# EAGLE design EsquematicoCorregido (EAGLE 9.6.2)
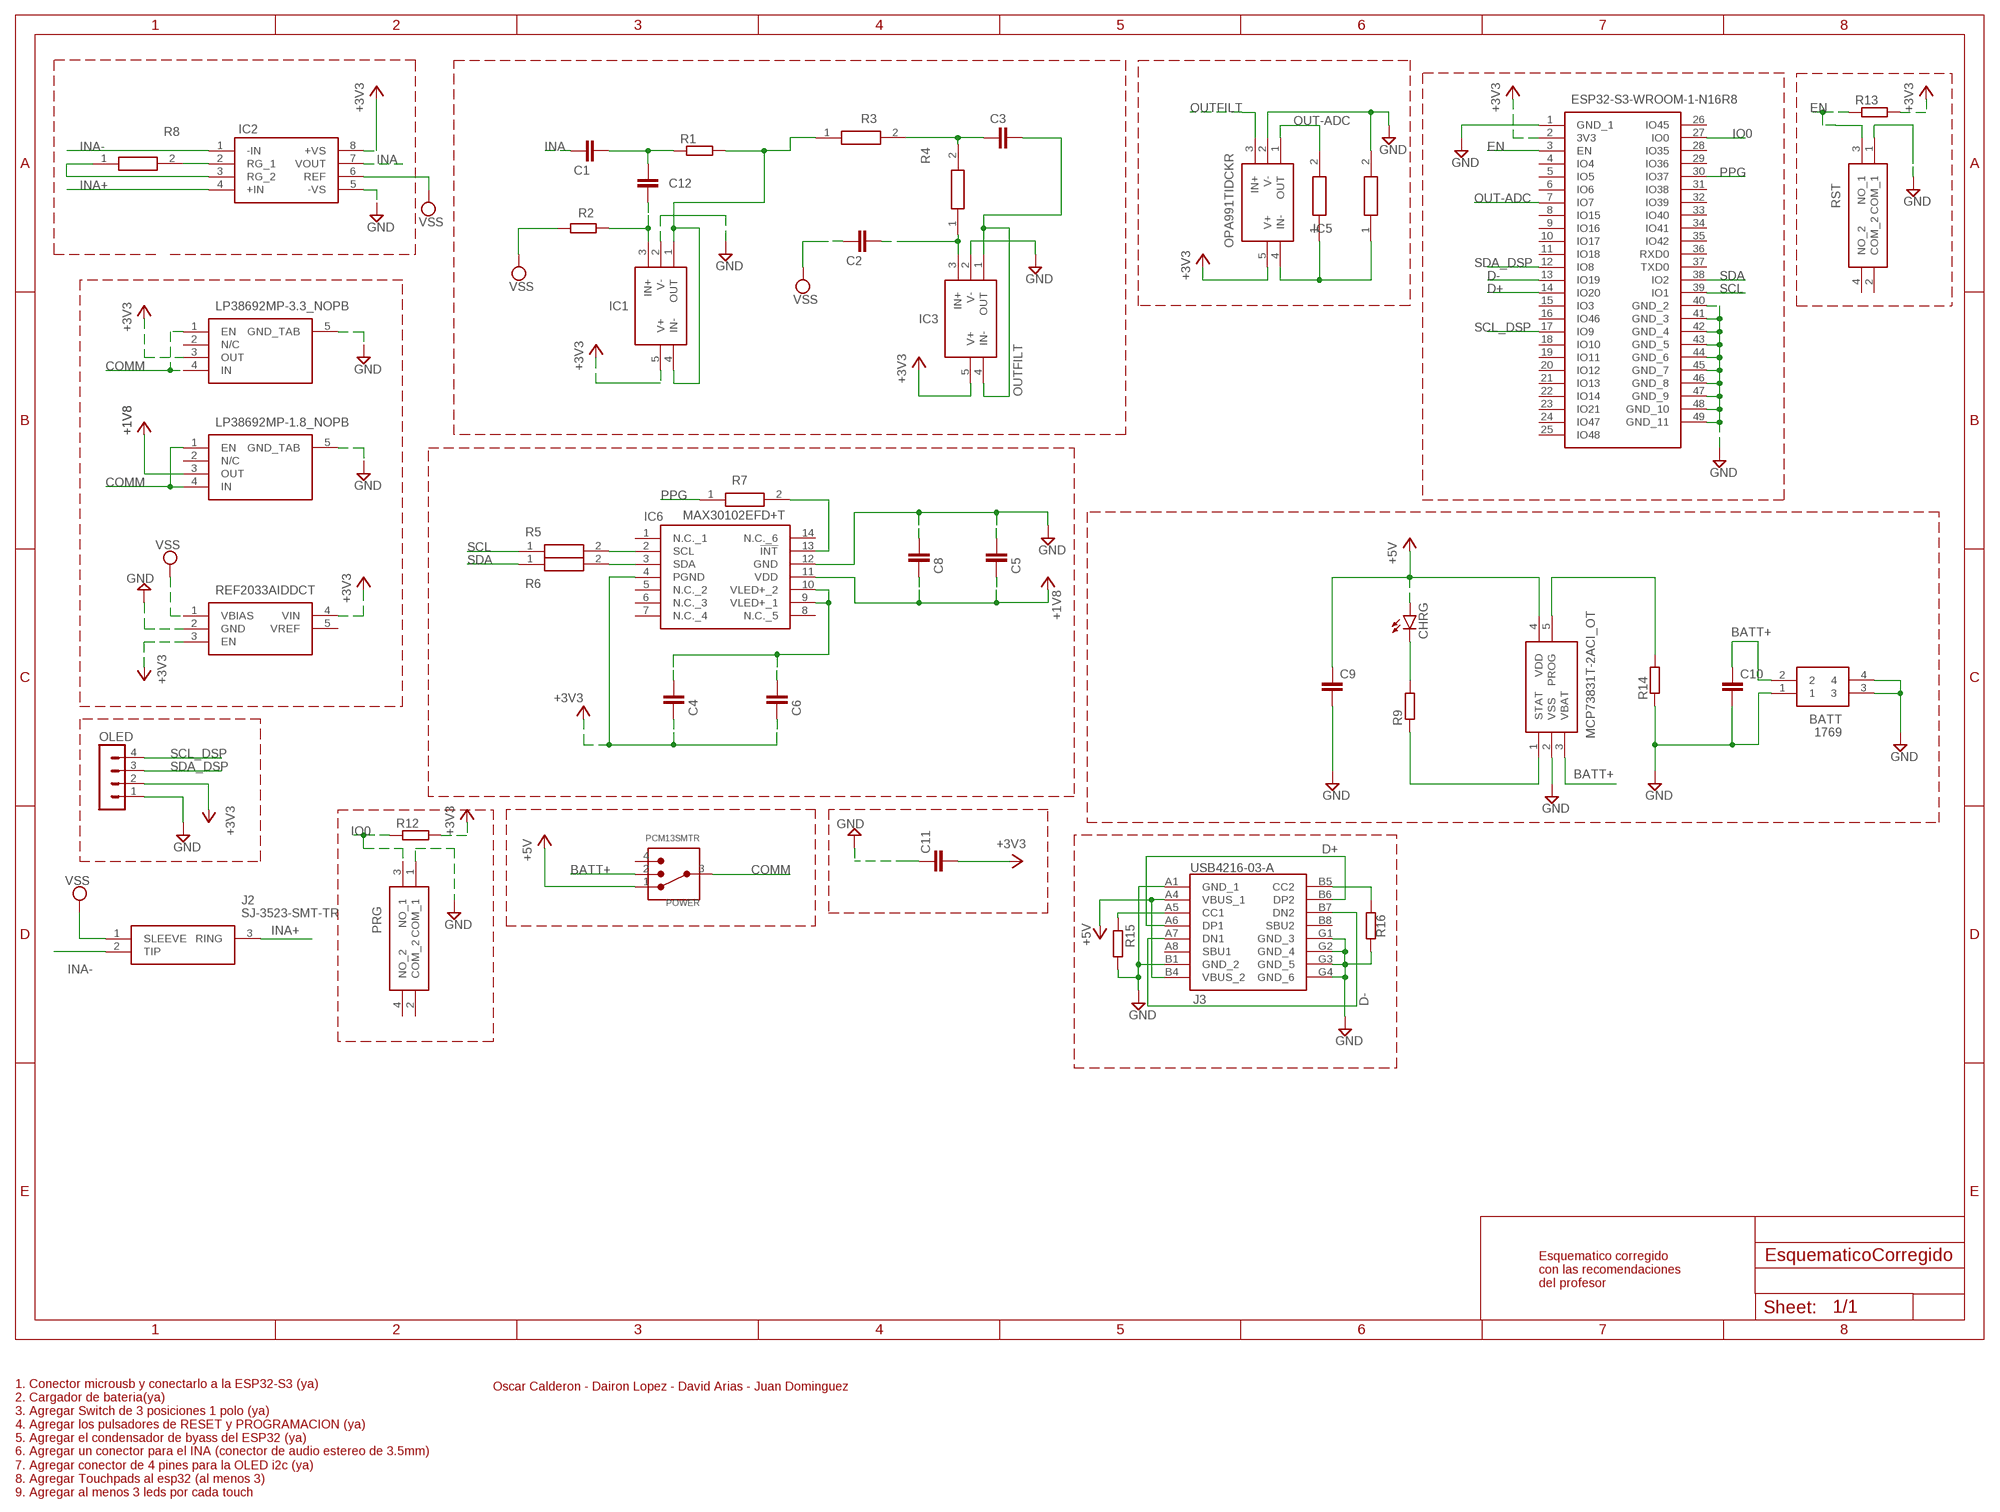
[diagram p0: schematic, sheet 1]

## Parts
BATT  1769  [1769]
C1  C-EUC0805  [C0805]
C2  C-EUC0805  [C0805]
C3  C-EUC0805  [C0805]
C4  C-EUC0805  [C0805]
C5  C-EUC0805  [C0805]
C6  C-EUC0805  [C0805]
C8  C-EUC0805  [C0805]
C9  C-EUC0805  [C0805]
C10  C-EUC0805  [C0805]
C11  C-EUC0805  [C0805]
C12  C-EUC0805  [C0805]
CHRG  LEDCHIP-LED0805  [CHIP-LED0805]
IC1  OPA991TIDCKR  [SOT65P210X110-5N]
IC2  AD8226ARZ-RL  [SOIC127P600X175-8N]
IC3  OPA991TIDCKR  [SOT65P210X110-5N]
IC4  ESP32-S3-WROOM-1-N16R8  [ESP32S3WROOM1N16R8]
IC5  OPA991TIDCKR  [SOT65P210X110-5N]
IC6  MAX30102EFD+T  [MAX30102EFDT]
IC7  LP38692MP-3.3_NOPB  [SOT150P700X180-5N]
IC8  LP38692MP-1.8_NOPB  [SOT150P700X180-5N]
IC9  REF2033AIDDCT  [SOT95P280X110-5N]
IC10  MCP73831T-2ACI_OT  [SOT95P270X145-5N]
J2  SJ-3523-SMT-TR  [SJ3523SMTTR]
J3  USB4216-03-A  [USB421603A]
OLED  MA04-1  [MA04-1]
POWER  PCM13SMTR  [SW_PCM13SMTR]
PRG  PTS526SK15SMTR2_LFS  [PTS526SK15SMTR2LFS]
R1  R-EU_R0805  [R0805]
R2  R-EU_R0805  [R0805]
R3  ERA-6ARW122V  [ERA6AEB101V]
R4  ERA-6ARW122V  [ERA6AEB101V]
R5  CRCW08051K00FKTAHP  [RESC2012X60N]
R6  CRCW08051K00FKTAHP  [RESC2012X60N]
R7  CRCW08051K00FKTAHP  [RESC2012X60N]
R8  RN73H1JTTD1043B50  [RESC1608X55N]
R9  R-EU_R0805  [R0805]
R10  CRCW0805220RFKTAHP  [RESC2012X60N]
R11  CRCW0805220RFKTAHP  [RESC2012X60N]
R12  R-EU_R0805  [R0805]
R13  R-EU_R0805  [R0805]
R14  R-EU_R0805  [R0805]
R15  R-EU_R0805  [R0805]
R16  R-EU_R0805  [R0805]
RST  PTS526SK15SMTR2_LFS  [PTS526SK15SMTR2LFS]

## Nets
+1V8: C5.1 C8.1 IC6.11(VDD) IC8.3(OUT) ; supply symbol labelled +3V3
+3V3: C4.1 C6.1 C11.2 IC1.5(V+) IC2.8(+VS) IC3.5(V+) IC4.2(3V3) IC5.5(V+) IC6.4(PGND) IC7.3(OUT) IC9.3(EN) IC9.4(VIN) OLED.2 R12.2 R13.2
+5V: C9.1 CHRG.A IC10.4(VDD) J3.A4(VBUS_1) J3.B4(VBUS_2) POWER.1
BATT+: BATT.2 C10.1 IC10.3(VBAT) POWER.2
COMM: IC7.1(EN) IC7.4(IN) IC8.1(EN) IC8.4(IN) POWER.3
D+: IC4.14(IO20) J3.A6(DP1) J3.B6(DP2)
D-: IC4.13(IO19) J3.A7(DN1) J3.B7(DN2)
EN: IC4.3(EN) R13.1 RST.3(NO_1)
GND: BATT.1 BATT.3 BATT.4 C5.2 C8.2 C9.2 C10.2 C11.1 IC1.2(V-) IC2.5(-VS) IC3.2(V-) IC4.1(GND_1) IC4.40(GND_2) IC4.41(GND_3) IC4.42(GND_4) IC4.43(GND_5) IC4.44(GND_6) IC4.45(GND_7) IC4.46(GND_8) IC4.47(GND_9) IC4.48(GND_10) IC4.49(GND_11) IC5.2(V-) IC6.12(GND) IC7.5(GND_TAB) IC8.5(GND_TAB) IC9.2(GND) IC10.2(VSS) J3.A1(GND_1) J3.B1(GND_2) J3.G1(GND_3) J3.G2(GND_4) J3.G3(GND_5) J3.G4(GND_6) OLED.1 PRG.1(COM_1) R11.2 R14.1 R15.2 R16.1 RST.1(COM_1)
INA: C1.1 IC2.7(VOUT)
INA+: IC2.4(+IN) J2.3(RING)
INA-: IC2.1(-IN) J2.2(TIP)
IO0: IC4.27(IO0) PRG.3(NO_1) R12.1
N$1: C3.2 R3.2 R4.2
N$2: C1.2 C12.2 R1.1
N$3: C12.1 IC1.3(IN+) R2.2
N$4: C2.2 IC3.3(IN+) R4.1
N$5: IC5.4(IN-) R10.1 R11.1
N$6: IC1.1(OUT) IC1.4(IN-) R1.2 R3.1
N$7: IC2.2(RG_1) R8.2
N$8: IC6.13(!INT) R7.2
N$9: C4.2 C6.2 IC6.9(VLED+_1) IC6.10(VLED+_2)
N$11: IC2.3(RG_2) R8.1
N$12: IC6.3(SDA) R6.2
N$13: IC6.2(SCL) R5.2
N$14: CHRG.C R9.2
N$16: J3.A5(CC1) R15.1
N$17: IC10.5(PROG) R14.2
N$18: IC10.1(STAT) R9.1
N$19: J3.B5(CC2) R16.2
OUT-ADC: IC4.7(IO7) IC5.1(OUT) R10.2
OUTFILT: C3.1 IC3.1(OUT) IC3.4(IN-) IC5.3(IN+)
PPG: IC4.30(IO37) R7.1
SCL: IC4.39(IO1) R5.1
SCL_DSP: IC4.17(IO9) OLED.4
SDA: IC4.38(IO2) R6.1
SDA_DSP: IC4.12(IO8) OLED.3
VSS: C2.1 IC2.6(REF) IC9.1(VBIAS) J2.1(SLEEVE) R2.1
Unconnected: IC4.4(IO4) IC4.5(IO5) IC4.6(IO6) IC4.8(IO15) IC4.9(IO16) IC4.10(IO17) IC4.11(IO18) IC4.15(IO3) IC4.16(IO46) IC4.18(IO10) IC4.19(IO11) IC4.20(IO12) IC4.21(IO13) IC4.22(IO14) IC4.23(IO21) IC4.24(IO47) IC4.25(IO48) IC4.26(IO45) IC4.28(IO35) IC4.29(IO36) IC4.31(IO38) IC4.32(IO39) IC4.33(IO40) IC4.34(IO41) IC4.35(IO42) IC4.36(RXD0) IC4.37(TXD0) IC6.1(N.C._1) IC6.5(N.C._2) IC6.6(N.C._3) IC6.7(N.C._4) IC6.8(N.C._5) IC6.14(N.C._6) IC7.2(N/C) IC8.2(N/C) IC9.5(VREF) J3.A8(SBU1) J3.B8(SBU2) POWER.4 PRG.2(COM_2) PRG.4(NO_2) RST.2(COM_2) RST.4(NO_2)

## Notes on the sheet
- Esquematico corregido
  con las recomendaciones
  del profesor
- Oscar Calderon - Dairon Lopez - David Arias - Juan Dominguez
- 1. Conector microusb y conectarlo a la ESP32-S3 (ya)
  2. Cargador de bateria(ya)
  3. Agregar Switch de 3 posiciones 1 polo (ya)
  4. Agregar los pulsadores de RESET y PROGRAMACION (ya)
  5. Agregar el condensador de byass del ESP32 (ya)
- 6. Agregar un conector para el INA (conector de audio estereo de 3.5mm)
- 7. Agregar conector de 4 pines para la OLED i2c (ya)
  8. Agregar Touchpads al esp32 (al menos 3)
  9. Agregar al menos 3 leds por cada touch

## Library data of the parts
BATT = 1769:1769: Adafruit Accessories JST-PH 2-pin SMT Right Angle Connect Source: Datasheet <https://cdn-shop.adafruit.com/datasheets/17311.pdf>; DESCRIPTION: Adafruit Accessories JST-PH 2-pin SMT Right Angle Connect; HEIGHT: 5.5mm; MANUFACTURER_NAME: Adafruit; MANUFACTURER_PART_NUMBER: 1769; MOUSER_PART_NUMBER: 485-1769; MOUSER_PRICE-STOCK: https://www.mouser.co.uk/ProductDetail/Adafruit/1769?qs=GURawfaeGuBbgoGtf2XstA%3D%3D
C1-C6 C8-C12 = rcl:C-EU: CAPACITOR, European symbol; SPICEPREFIX: C
CHRG = led:LED: LED OSRAM: - CHIPLED LG R971, LG N971, LY N971, LG Q971, LY Q971, LO R971, LY R971 LH N974, LH R974 LS Q976, LO Q976, LY Q976 LO Q996 - Hyper CHIPLED LW Q18S LB Q993, LB Q99A, LB R99A - SideLED LS A670, LO A670, LY A670, LG A670, LP A670 LB A673, LV A673, LT A673, LW A673 LH A674 LY A675 LS A676, LA A676, LO A676, LY A676, LW A676 LS A679, LY A679, LG A679 - Hyper Micro SIDELED® LS Y876, LA Y876, LO Y876, LY Y876 LT Y87S - SmartLED LW L88C, LW L88S LB L89C, LB L89S, LG L890 LS L89K, LO L89K, LY L89K LS L896, LA L896, LO L896, LY L896 - TOPLED LS T670, LO T670, LY T670, LG T670, LP T670 LSG T670, LSP T670, LSY T670, LOP T670, LYG T670 LG T671, LOG T671, LSG T671 LB T673, LV T673, LT T673, LW T673 LH T674 LS T676, LA T676, LO T676, LY T676, LB T676, LH T676, LSB T676, LW T676 LB T67C, LV T67C, LT T67C, LS T67K, LO T67K, LY T67K, LW E67C LS E67B, LA E67B, LO E67B, LY E67B, LB E67C, LV E67C, LT E67C LW T67C LS T679, LY T679, LG T679 LS T770, LO T770, LY T770, LG T770, LP T770 LB T773, LV T773, LT T773, LW T773 LH T774 LS E675, LA E675, LY E675, LS T675 LS T776, LA T776, LO T776, LY T776, LB T776 LHGB T686 LT T68C, LB T68C - Hyper Mini TOPLED® LB M676 - Mini TOPLED Santana® LG M470 LS M47K, LO M47K, LY M47K Source: http://www.osram.convergy.de LUXEON: - LUMILED® LXK2-PW12-R00, LXK2-PW12-S00, LXK2-PW14-U00, LXK2-PW14-V00 LXK2-PM12-R00, LXK2-PM12-S00, LXK2-PM14-U00 LXK2-PE12-Q00, LXK2-PE12-R00, LXK2-PE12-S00, LXK2-PE14-T00, LXK2-PE14-U00 LXK2-PB12-K00, LXK2-PB12-L00, LXK2-PB12-M00, LXK2-PB14-N00, LXK2-PB14-P00, LXK2-PB14-Q00 LXK2-PR12-L00, LXK2-PR12-M00, LXK2-PR14-Q00, LXK2-PR14-R00 LXK2-PD12-Q00, LXK2-PD12-R00, LXK2-PD12-S00 LXK2-PH12-R00, LXK2-PH12-S00 LXK2-PL12-P00, LXK2-PL12-Q00, LXK2-PL12-R00 Source: www.luxeon.com KINGBRIGHT: KA-3528ASYC Source: www.kingbright.com
IC1 IC3 IC5 = OPA991TIDCKR:OPA991TIDCKR: Operational Amplifiers - Op Amps 40-V, single 4.5MHz, rail-to-rail input/output, low-offset-voltage, low-noise op amp Source: Datasheet; DESCRIPTION: Operational Amplifiers - Op Amps 40-V, single 4.5MHz, rail-to-rail input/output, low-offset-voltage, low-noise op amp; HEIGHT: 1.1mm; MANUFACTURER_NAME: Texas Instruments; MANUFACTURER_PART_NUMBER: OPA991TIDCKR; MOUSER_PART_NUMBER: 595-OPA991TIDCKR; MOUSER_PRICE-STOCK: https://www.mouser.co.uk/ProductDetail/Texas-Instruments/OPA991TIDCKR?qs=Wj%2FVkw3K%252BMD%2FIzu2Yv2xzw%3D%3D
IC2 = AD8226ARZ-RL:AD8226ARZ-RL: Wide Supply Range, Rail-to-Rail Output Instrumentation Amplifier Source: Datasheet <https://componentsearchengine.com/Datasheets/1/AD8226ARZ-RL.pdf>; DESCRIPTION: Wide Supply Range, Rail-to-Rail Output Instrumentation Amplifier; HEIGHT: 1.75mm; MANUFACTURER_NAME: Analog Devices; MANUFACTURER_PART_NUMBER: AD8226ARZ-RL; MOUSER_PART_NUMBER: 584-AD8226ARZ-R; MOUSER_PRICE-STOCK: https://www.mouser.co.uk/ProductDetail/Analog-Devices/AD8226ARZ-RL?qs=%2FtpEQrCGXCyR%252B4VhfaaPUA%3D%3D
IC4 = ESP32-S3-WROOM-1-N16R8:ESP32-S3-WROOM-1-N16R8: Multiprotocol Modules SMD Module, ESP32-S3R8, 3.3V, 8 MB Octal PSRAM Die, 16 MB Quad SPI Flash, PCB Antenna Source: Datasheet <https://www.espressif.com/sites/default/files/documentation/esp32-s3-wroom-1_wroom-1u_datasheet_en.pdf>; DESCRIPTION: Multiprotocol Modules SMD Module, ESP32-S3R8, 3.3V, 8 MB Octal PSRAM Die, 16 MB Quad SPI Flash, PCB Antenna; HEIGHT: 3.25mm; MANUFACTURER_NAME: Espressif Systems; MANUFACTURER_PART_NUMBER: ESP32-S3-WROOM-1-N16R8; MOUSER_PART_NUMBER: 356-ESP32S3WRM1N16R8; MOUSER_PRICE-STOCK: https://www.mouser.co.uk/ProductDetail/Espressif-Systems/ESP32-S3-WROOM-1-N16R8?qs=Li%252BoUPsLEnvQc9gW6AMhZg%3D%3D
IC6 = MAX30102EFD+T:MAX30102EFD+T: Biometric Sensors Integrated Optical Sensor Source: Datasheet <https://www.analog.com/media/en/technical-documentation/data-sheets/MAX30102.pdf>; DESCRIPTION: Biometric Sensors Integrated Optical Sensor; HEIGHT: 1.65mm; MANUFACTURER_NAME: Analog Devices; MANUFACTURER_PART_NUMBER: MAX30102EFD+T; MOUSER_PART_NUMBER: 700-MAX30102EFD+T; MOUSER_PRICE-STOCK: https://www.mouser.co.uk/ProductDetail/Analog-Devices-Maxim-Integrated/MAX30102EFD%2bT?qs=nVS1qgv%252BQrkHA4%2FoFYriFA%3D%3D
IC7 = LP38692MP-3.3_NOPB:LP38692MP-3.3_NOPB: LP38692MP-3.3/NOPB, Low Dropout Voltage Regulator, 1A, 3.3 V +/-2.5%, 2.7 10 Vin, 5-Pin SOT-223 Source: Datasheet <http://www.ti.com/lit/ds/symlink/lp38692.pdf>; DESCRIPTION: LP38692MP-3.3/NOPB, Low Dropout Voltage Regulator, 1A, 3.3 V +/-2.5%, 2.7 10 Vin, 5-Pin SOT-223; HEIGHT: 1.8mm; MANUFACTURER_NAME: Texas Instruments; MANUFACTURER_PART_NUMBER: LP38692MP-3.3/NOPB; MOUSER_PART_NUMBER: 926-LP38692MP3.3NOPB; MOUSER_PRICE-STOCK: https://www.mouser.co.uk/ProductDetail/Texas-Instruments/LP38692MP-3.3-NOPB?qs=1FNqv8aZn1TpKuOP2NKBdg%3D%3D
IC8 = LP38692MP-1.8_NOPB:LP38692MP-1.8_NOPB: LP38692MP-1.8/NOPB, Low Dropout Voltage Regulator, 1A, 1.8 V +/-2.5%, 2.7 10 Vin, 5-Pin SOT-223 Source: Datasheet <http://www.ti.com/lit/ds/symlink/lp38692.pdf>; DESCRIPTION: LP38692MP-1.8/NOPB, Low Dropout Voltage Regulator, 1A, 1.8 V +/-2.5%, 2.7 10 Vin, 5-Pin SOT-223; HEIGHT: 1.8mm; MANUFACTURER_NAME: Texas Instruments; MANUFACTURER_PART_NUMBER: LP38692MP-1.8/NOPB; MOUSER_PART_NUMBER: 926-LP38692MP18NOPB; MOUSER_PRICE-STOCK: https://www.mouser.co.uk/ProductDetail/Texas-Instruments/LP38692MP-1.8-NOPB?qs=1FNqv8aZn1ScMhd5Fp7uyA%3D%3D
IC9 = REF2033AIDDCT:REF2033AIDDCT: Low-Drift, Low-Power, Dual-Output VREF and VREF/2 Voltage Reference Source: Datasheet <http://www.ti.com/lit/gpn/ref2033>; DESCRIPTION: Low-Drift, Low-Power, Dual-Output VREF and VREF/2 Voltage Reference; HEIGHT: 1.1mm; MANUFACTURER_NAME: Texas Instruments; MANUFACTURER_PART_NUMBER: REF2033AIDDCT; MOUSER_PART_NUMBER: 595-REF2033AIDDCT; MOUSER_PRICE-STOCK: https://www.mouser.co.uk/ProductDetail/Texas-Instruments/REF2033AIDDCT?qs=7z%252BmIopC6%2FIc00c0wUqUCA%3D%3D
IC10 = MCP73831T-2ACI_OT:MCP73831T-2ACI_OT: Li-Ion Charge Controller 4.2V SOT23-5 Source: Datasheet <http://ww1.microchip.com/downloads/en/DeviceDoc/20001984g.pdf>; DESCRIPTION: Li-Ion Charge Controller 4.2V SOT23-5; HEIGHT: 1.45mm; MANUFACTURER_NAME: Microchip; MANUFACTURER_PART_NUMBER: MCP73831T-2ACI/OT; MOUSER_PART_NUMBER: 579-MCP73831T-2ACIOT; MOUSER_PRICE-STOCK: https://www.mouser.co.uk/ProductDetail/Microchip-Technology/MCP73831T-2ACI-OT?qs=yUQqVecv4qvbBQBGbHx0Mw%3D%3D
J2 = SJ-3523-SMT-TR:SJ-3523-SMT-TR: 3.5 mm, Stereo, Right Angle, Surface Mount (SMT), 3 Conductors, 0 Internal Switches, Audio Jack Connector Source: Datasheet <https://www.sameskydevices.com/product/resource/sj-352x-smt.pdf>; DESCRIPTION: 3.5 mm, Stereo, Right Angle, Surface Mount (SMT), 3 Conductors, 0 Internal Switches, Audio Jack Connector; HEIGHT: 5.2mm; MANUFACTURER_NAME: Same Sky; MANUFACTURER_PART_NUMBER: SJ-3523-SMT-TR; MOUSER_PART_NUMBER: 490-SJ-3523-SMT-TR; MOUSER_PRICE-STOCK: https://www.mouser.co.uk/ProductDetail/CUI-Devices/SJ-3523-SMT-TR?qs=WyjlAZoYn51zOHzJ3r4ZRA%3D%3D
J3 = USB4216-03-A:USB4216-03-A: USB Connectors USB C Receptacle, Short Body, USB2.0, 16Pin, Horizontal, SMT Source: Datasheet; DESCRIPTION: USB Connectors USB C Receptacle, Short Body, USB2.0, 16Pin, Horizontal, SMT; HEIGHT: mm; MANUFACTURER_NAME: GCT (GLOBAL CONNECTOR TECHNOLOGY); MANUFACTURER_PART_NUMBER: USB4216-03-A; MOUSER_PART_NUMBER: 640-USB4216-03-A; MOUSER_PRICE-STOCK: https://www.mouser.co.uk/ProductDetail/GCT/USB4216-03-A?qs=Tc%252BHE9vUsnv1G2UWLFIexA%3D%3D
OLED = con-lstb:MA04-1: PIN HEADER; OC_FARNELL: unknown; OC_NEWARK: unknown
POWER = PCM13SMTR:PCM13SMTR: Check availability <https://pricing.snapeda.com/parts/PCM13SMTR/C%26K/view-part?ref=eda>; AVAILABILITY: In Stock; CHECK_PRICES: https://www.snapeda.com/parts/PCM13SMTR/C%2526K/view-part/?ref=eda; DESCRIPTION: Slide Switch SP3T Surface Mount, Right Angle; MF: C&K; MP: PCM13SMTR; PACKAGE: None; PRICE: None; SNAPEDA_LINK: https://www.snapeda.com/parts/PCM13SMTR/C%2526K/view-part/?ref=snap
PRG RST = PTS526SK15SMTR2_LFS:PTS526SK15SMTR2_LFS: Tactile Switches 50mA 12VDC, 5.2x5.2mm, 1.5mm H, 260gf, G leads, No ground pin, metal actuator Source: Datasheet <https://www.ckswitches.com/media/2780/pts526.pdf>; DESCRIPTION: Tactile Switches 50mA 12VDC, 5.2x5.2mm, 1.5mm H, 260gf, G leads, No ground pin, metal actuator; HEIGHT: 1.65mm; MANUFACTURER_NAME: C & K COMPONENTS; MANUFACTURER_PART_NUMBER: PTS526SK15SMTR2 LFS; MOUSER_PART_NUMBER: 611-PTS526SK15SMR2L; MOUSER_PRICE-STOCK: https://www.mouser.co.uk/ProductDetail/CK/PTS526SK15SMTR2-LFS?qs=Imq1NPwxi75hkPN8%252BRLw6Q%3D%3D
R1 R2 R9 R12-R16 = rcl:R-EU_: RESISTOR, European symbol; SPICEPREFIX: R
R3 R4 = ERA-6ARW122V:ERA-6ARW122V: Thin Film Resistors - SMD 0805 1.2Kohm 0.05% 10ppm AEC-Q200 Source: Datasheet <https://industrial.panasonic.com/cdbs/www-data/pdf/RDM0000/AOA0000C307.pdf>; DESCRIPTION: Thin Film Resistors - SMD 0805 1.2Kohm 0.05% 10ppm AEC-Q200; HEIGHT: 0.6mm; MANUFACTURER_NAME: Panasonic; MANUFACTURER_PART_NUMBER: ERA-6ARW122V; MOUSER_PART_NUMBER: 667-ERA-6ARW122V; MOUSER_PRICE-STOCK: https://www.mouser.co.uk/ProductDetail/Panasonic/ERA-6ARW122V?qs=ob%252BdNz2%252BYEj%252BWeFiHaJGkA%3D%3D
R5-R7 = CRCW08051K00FKTAHP:CRCW08051K00FKTAHP: HP Thick Film Chip Resistors value 1K00 ohm. Source: Datasheet <https://componentsearchengine.com/Datasheets/1/CRCW08051R00FKEAHP.pdf>; DESCRIPTION: HP Thick Film Chip Resistors value 1K00 ohm.; HEIGHT: 0.6mm; MANUFACTURER_NAME: Vishay; MANUFACTURER_PART_NUMBER: CRCW08051K00FKTAHP
R8 = RN73H1JTTD1043B50:RN73H1JTTD1043B50: Thin Film Resistors - SMD 104kOhm,0603,0.1%,50 ppm,100mW,75V Source: Datasheet <https://componentsearchengine.com/Datasheets/1/RN73H1JTTD1043B50.pdf>; DESCRIPTION: Thin Film Resistors - SMD 104kOhm,0603,0.1%,50 ppm,100mW,75V; HEIGHT: 0.55mm; MANUFACTURER_NAME: KOA Speer; MANUFACTURER_PART_NUMBER: RN73H1JTTD1043B50; MOUSER_PART_NUMBER: 660-RN73H1JTD1043B50; MOUSER_PRICE-STOCK: https://www.mouser.com/Search/Refine.aspx?Keyword=660-RN73H1JTD1043B50
R10 R11 = CRCW0805220RFKTAHP:CRCW0805220RFKTAHP: HP Thick Film Chip Resistors value 220R ohm. Source: Datasheet <https://componentsearchengine.com/Datasheets/1/CRCW08051R00FKEAHP.pdf>; DESCRIPTION: HP Thick Film Chip Resistors value 220R ohm.; HEIGHT: 0.6mm; MANUFACTURER_NAME: Vishay; MANUFACTURER_PART_NUMBER: CRCW0805220RFKTAHP

## Board
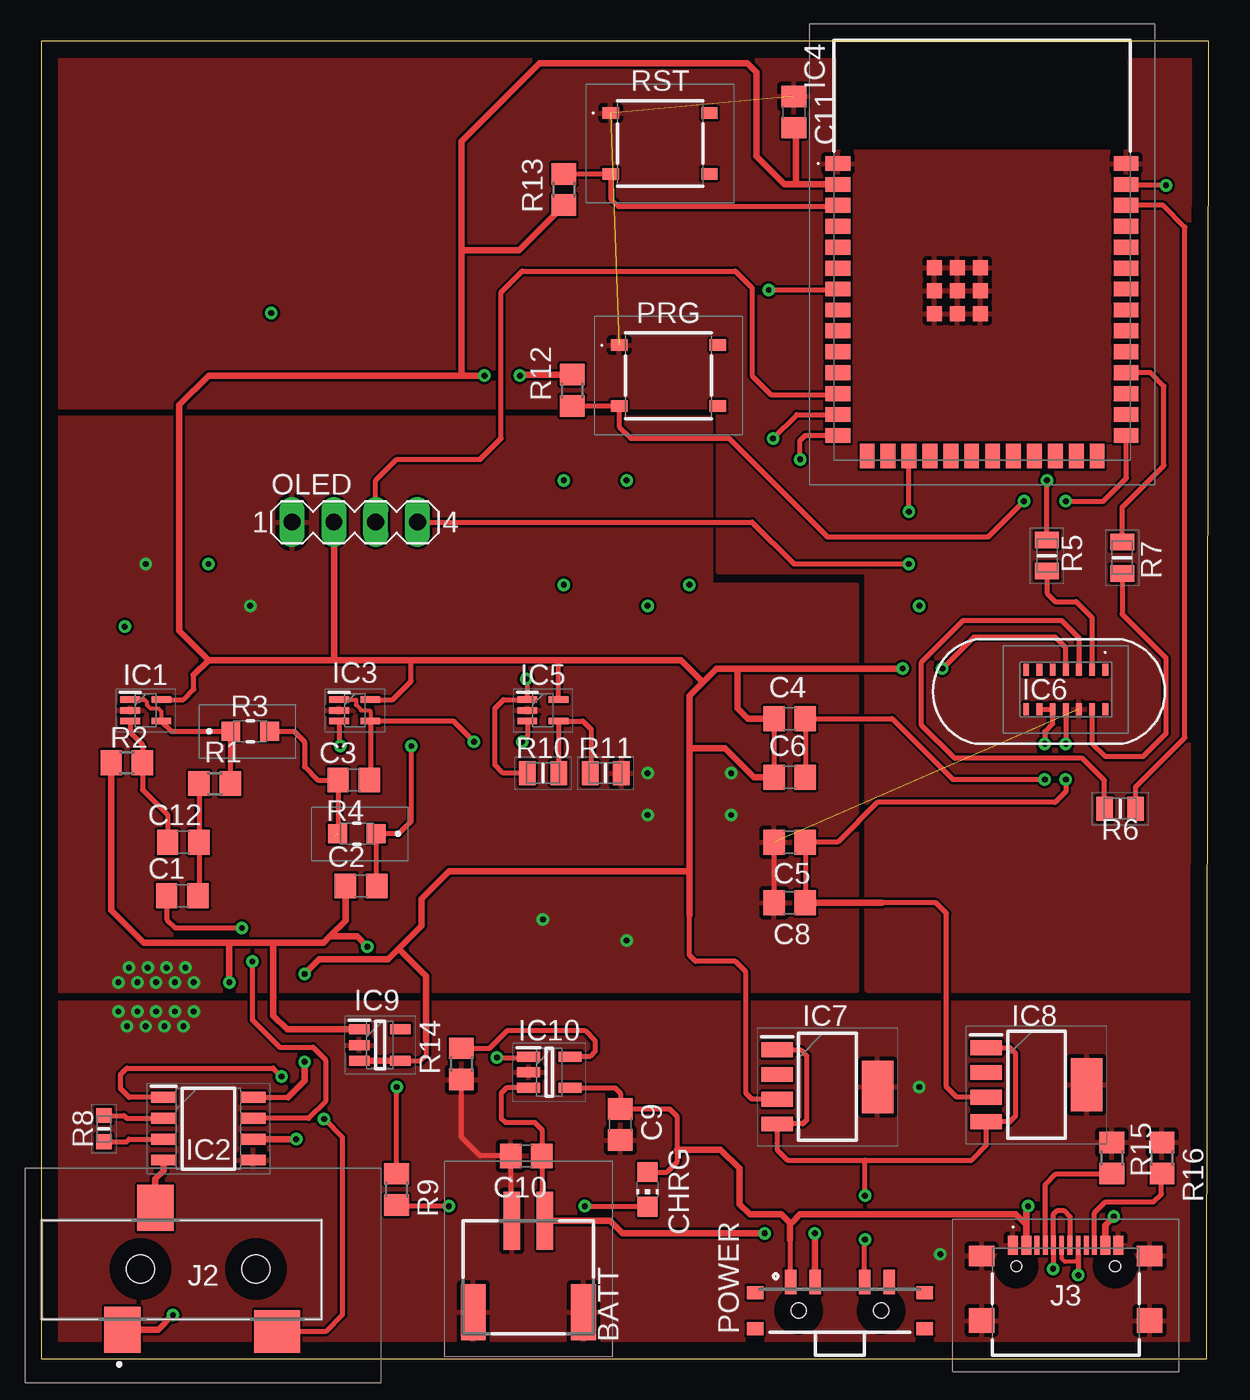
[diagram p1: board, top side]
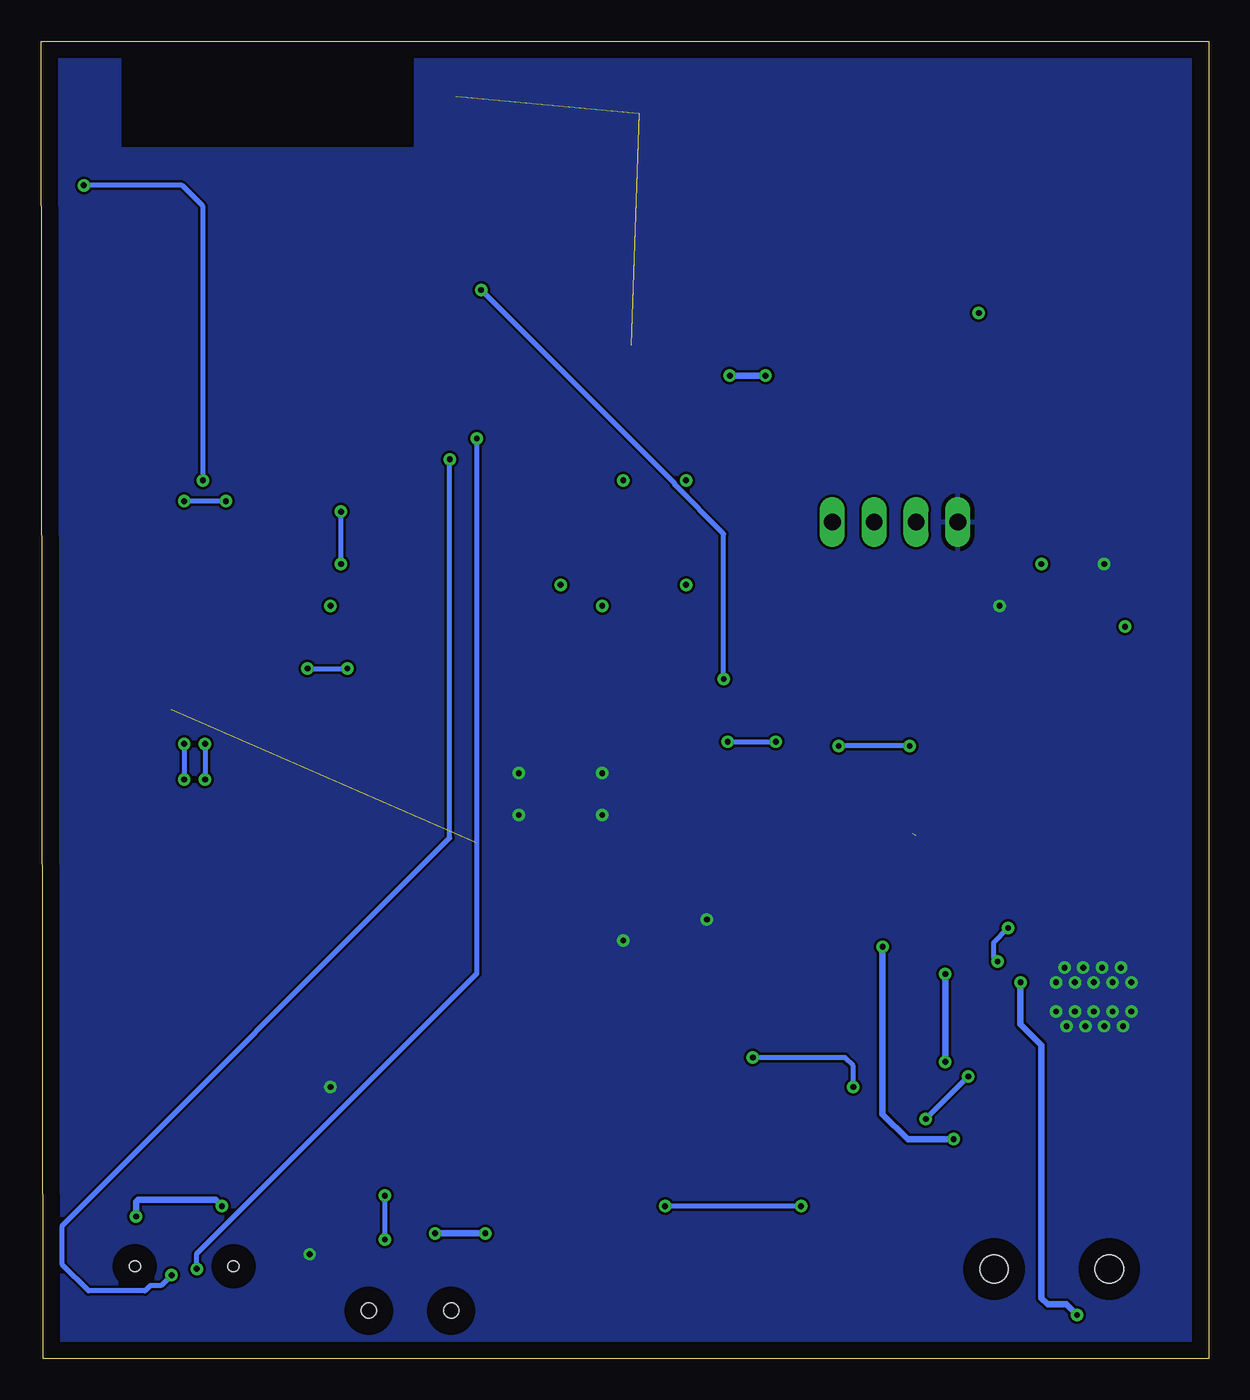
[diagram p2: board, bottom side, seen from below]

Size 70.92 x 80 mm. Coordinates in mm from the lower left corner, seen from the top.
Outline: 0,0 70.79,0 70.92,80 0,80 0,0
Copper layers (1*16): Top 0.035mm / dielectric 1.5mm / Bottom 0.035mm
Design rules "default": minimum track width 6mil, minimum drill 0.35mm, track to track 6mil, track to pad 6mil, pad to pad 6mil, via to via 6mil, smd to smd 6mil, copper to edge 40mil, drill to drill 6mil, minimum pad ring 10mil, minimum via ring 8mil, stop-mask expansion 4mil, vias tented up to drill 0mil, thermal gap 10mil

### Footprints (pad centres in the part's own frame; a part is rotated, then mirrored left to right if it is on the bottom)
1769 = smd 1 x 3.5: 1 -1,0; 2 1,0 | smd 1.5 x 3.4: 3 -3.35,-5.55; 4 3.35,-5.55
C0805 = smd 1.3 x 1.5: 1 -0.95,0; 2 0.95,0
CHIP-LED0805 = smd 1.2 x 1.2: A 0,-1.05; C 0,1.05
SOT65P210X110-5N = smd 1.2 x 0.4: 1 -0.95,0.65; 2 -0.95,0; 3 -0.95,-0.65; 4 0.95,-0.65; 5 0.95,0.65
SOIC127P600X175-8N = smd 1.525 x 0.65: 1 -2.712,1.905; 2 -2.712,0.635; 3 -2.712,-0.635; 4 -2.712,-1.905; 5 2.712,-1.905; 6 2.712,-0.635; 7 2.712,0.635; 8 2.712,1.905
ESP32S3WROOM1N16R8 = smd 1.5 x 0.9: 1 -8.75,5.26; 2 -8.75,3.99; 3 -8.75,2.72; 4 -8.75,1.45; 5 -8.75,0.18; 6 -8.75,-1.09; 7 -8.75,-2.36; 8 -8.75,-3.63; 9 -8.75,-4.9; 10 -8.75,-6.17; 11 -8.75,-7.44; 12 -8.75,-8.71; 13 -8.75,-9.98; 14 -8.75,-11.25; 27 8.75,-11.25; 28 8.75,-9.98; 29 8.75,-8.71; 30 8.75,-7.44; 31 8.75,-6.17; 32 8.75,-4.9; 33 8.75,-3.63; 34 8.75,-2.36; 35 8.75,-1.09; 36 8.75,0.18; 37 8.75,1.45; 38 8.75,2.72; 39 8.75,3.99; 40 8.75,5.26 | smd 0.9 x 1.5: 15 -6.985,-12.5; 16 -5.715,-12.5; 17 -4.445,-12.5; 18 -3.175,-12.5; 19 -1.905,-12.5; 20 -0.635,-12.5; 21 0.635,-12.5; 22 1.905,-12.5; 23 3.175,-12.5; 24 4.445,-12.5; 25 5.715,-12.5; 26 6.985,-12.5 | smd 0.9 x 0.9: 41 -1.5,-2.46; 42 -2.9,-1.06; 43 -2.9,-2.46; 44 -2.9,-3.86; 45 -1.5,-3.86; 46 -0.1,-3.86; 47 -0.1,-2.46; 48 -0.1,-1.06; 49 -1.5,-1.06
MAX30102EFDT = smd 0.75 x 0.35: 1 -1.2,2.4; 2 -1.2,1.6; 3 -1.2,0.8; 4 -1.2,0; 5 -1.2,-0.8; 6 -1.2,-1.6; 7 -1.2,-2.4; 8 1.2,-2.4; 9 1.2,-1.6; 10 1.2,-0.8; 11 1.2,0; 12 1.2,0.8; 13 1.2,1.6; 14 1.2,2.4
SOT150P700X180-5N = smd 1.9 x 0.9: 1 -3.05,2.25; 2 -3.05,0.75; 3 -3.05,-0.75; 4 -3.05,-2.25 | smd 1.9 x 3.2: 5 3.05,0
SOT95P280X110-5N = smd 1.25 x 0.6: 1 -1.25,0.95; 2 -1.25,0; 3 -1.25,-0.95; 4 1.25,-0.95; 5 1.25,0.95
SOT95P270X145-5N = smd 1.4 x 0.6: 1 -1.25,0.95; 2 -1.25,0; 3 -1.25,-0.95; 4 1.25,-0.95; 5 1.25,0.95
SJ3523SMTTR = smd 2.2 x 2.8: 1 2.4,-3.7; 3 4.4,3.7 | smd 2.8 x 2.6: 2 11.8,-3.8 | hole 1.7: 3.5,0; 10.5,0
USB421603A = smd 0.6 x 1.15: A1 -3.2,3.338; A4 -2.4,3.338; B1 3.2,3.338; B4 2.4,3.338 | smd 0.3 x 1.15: A5 -1.25,3.338; A6 -0.25,3.338; A7 0.25,3.338; A8 1.25,3.338; B5 1.75,3.338; B6 0.75,3.338; B7 -0.75,3.338; B8 -1.75,3.338 | smd 1.55 x 1.25: G1 -5.095,2.688; G2 5.095,2.688 | smd 1.55 x 1.5: G3 5.095,-1.237; G4 -5.095,-1.237 | hole 0.65: -3,2.063; 3,2.063
MA04-1 = drill 1.016 long: 1 -3.81,0; 2 -1.27,0; 3 1.27,0; 4 3.81,0
SW_PCM13SMTR = smd 0.7 x 1.5: 1 -3,1.75; 2 -1.5,1.75; 3 1.5,1.75; 4 3,1.75 | smd 1 x 0.8: P$1 -5.15,1.1; P$2 -5.15,-1.1; P$3 5.15,1.1; P$4 5.15,-1.1 | hole 0.9: -2.5,0; 2.5,0
PTS526SK15SMTR2LFS = smd 1 x 0.7: 1 -3,1.85; 2 3,1.85; 3 -3,-1.85; 4 3,-1.85
R0805 = smd 1.3 x 1.5: 1 -0.95,0; 2 0.95,0
ERA6AEB101V = smd 1.15 x 1.15: 1 -1.175,0; 2 1.175,0
RESC2012X60N = smd 1 x 1.45: 1 -0.95,0; 2 0.95,0
RESC1608X55N = smd 0.9 x 0.95: 1 -0.8,0; 2 0.8,0

### Placement (x,y rotation side)
BATT  29.59,8.38 0 top
C1  8.57,28.11 0 top
C2  19.43,28.7 0 top
C3  18.98,35.14 180 top
C4  45.47,38.86 0 top
C5  45.47,31.37 180 top
C6  45.47,35.31 0 top
C8  45.47,27.69 180 top
C9  35.18,14.22 270 top
C10  29.46,12.32 180 top
C11  45.72,75.69 270 top
C12  8.64,31.37 0 top
CHRG  36.83,10.29 180 top
IC1  6.35,39.37 0 top
IC2  10.16,13.97 0 top
IC3  19.05,39.37 0 top
IC4  57.15,67.31 0 top
IC5  30.48,39.37 0 top
IC6  62.23,40.64 270 top
IC7  47.75,16.51 0 top
IC8  60.45,16.64 0 top
IC9  20.57,19.05 0 top
IC10  30.86,17.4 0 top
J2  2.54,5.46 0 top
J3  62.23,3.56 0 top
OLED  19.05,50.8 0 top
POWER  48.51,2.92 0 top
PRG  38.1,59.69 0 top
R1  10.54,34.92 0 top
R2  5.21,36.2 0 top
R3  12.7,38.1 0 top
R4  19.18,31.88 180 top
R5  61.09,48.77 270 top
R6  65.53,33.4 180 top
R7  65.66,48.64 270 top
R8  3.81,13.97 90 top
R9  21.59,10.29 270 top
R10  30.48,35.56 180 top
R11  34.29,35.56 0 top
R12  32.26,58.8 90 top
R13  31.75,70.99 270 top
R14  25.53,17.91 90 top
R15  65.02,12.19 90 top
R16  68.07,12.19 270 top
RST  37.59,73.79 0 top

### Tracks (layer width: path | path; a pad name or v marks a point on that pad's centre or on a via)
+1V8  (via drill 0.35)
  Top 0.305: v62.23,35.18 62.23,34.42 61.59,33.78 50.8,33.78 48.39,31.37 C5.1 C8.1 | IC6.11 v62.23,37.34 | IC8.3 55.61,15.89 54.99,16.51 54.99,27.05 54.36,27.69 50.42,27.69
  Top 0.406: C8.1 50.42,27.69 51.05,27.69 | 57.39,15.88 IC8.3
  Bottom 0.305: v62.23,37.34 v62.23,35.18
+3V3  (via drill 0.35)
  Top 0.305: IC6.4 62.23,43.18 61.59,43.81 56.64,43.81 v54.74,41.91 | 44.69,15.75 IC7.3 43.17,15.76 42.8,16.13 42.8,23.5 42.16,24.13 39.75,24.13 39.37,24.51 39.37,26.92 | C4.1 C6.1 | IC1.5 8.65,40.02 9.27,40.64 9.27,41.53 | IC3.5 21.35,40.02 22.48,41.15 22.48,42.42 | IC5.5 31.43,42.36 31.37,42.42 | IC2.8 14.99,15.88 | IC9.4 23.05,18.1 23.37,18.41 23.37,19.3
  Top 0.406: 39.37,37.08 39.37,40.26 40.2,41.08 | 39.37,37.08 39.37,29.59 | 39.37,26.92 39.37,29.59 | 40.2,41.08 41.02,41.91 42.29,41.91 | 42.29,41.91 v52.32,41.91 | C4.1 42.93,38.86 42.29,39.5 42.29,41.91 | 9.27,41.53 10.16,42.42 | 40.2,41.08 38.86,42.42 31.37,42.42 22.48,42.42 17.78,42.42 | 10.16,42.42 17.78,42.42 | OLED.2 17.78,42.42 | 14.99,15.88 16,16.89 v16,18.03 | v16,23.37 16.89,24.26 21.08,24.26 21.72,24.89 | 21.72,24.89 23.11,26.29 23.11,27.94 24.77,29.59 39.37,29.59 | 21.72,24.89 23.37,23.24 23.37,19.3 | IC9.3 IC9.4 | C6.1 43.31,35.31 41.53,37.08 39.37,37.08 | R12.2 29.14,59.75 v29.08,59.69 | v26.92,59.69 25.53,59.69 | 25.53,59.69 10.16,59.69 8.38,57.91 8.38,44.2 10.16,42.42 | IC4.2 45.85,71.3 | 45.85,71.3 45.16,71.3 43.43,73.03 43.43,78.11 42.88,78.65 30.27,78.65 25.53,73.91 25.53,67.31 | 25.53,67.31 25.53,59.69 | C11.2 45.85,74.61 45.85,71.3 | R13.2 29.02,67.31 25.53,67.31
  Bottom 0.305: v54.74,41.91 v52.32,41.91
  Bottom 0.406: v16,18.03 v16,23.37 | v29.08,59.69 v26.92,59.69
+5V  (via drill 0.35)
  Top 0.305: CHRG.A 38.01,11.34 38.61,11.94 38.61,12.7 38.61,14.73 38.17,15.17 C9.1 35.18,16.13 34.86,16.45 IC10.4 | 45.47,7.24 45.47,4.72 POWER.1 | J3.A4 59.83,6.91 59.85,6.93
  Top 0.406: J3.B4 64.63,8.12 v65.15,8.64 | v59.94,9.27 59.85,9.17 59.85,8.13 | 59.85,6.93 59.85,8.13 | 38.61,12.7 41.27,12.7 42.42,11.56 42.42,9.4 43.05,8.76 44.96,8.76 45.47,8.26 | 45.47,8.26 45.47,7.24 | 45.47,8.26 45.59,8.26 46.1,8.76 59.21,8.76 59.85,8.13
  Bottom 0.406: v65.15,8.64 65.15,9.53 65.02,9.65 60.33,9.65 v59.94,9.27
BATT+  (via drill 0.35)
  Top 0.305: BATT.2 30.41,8.56 C10.1 30.41,13.91 29.97,14.35 28.19,14.35 27.94,14.61 27.94,16.13 28.26,16.45 IC10.3
  Top 0.406: BATT.2 34.54,8.38 35.31,7.62 v43.94,7.62 | v46.99,7.62 46.99,4.7 POWER.2
  Bottom 0.406: v43.94,7.62 v46.99,7.62
COMM  (via drill 0.35)
  Top 0.305: IC7.1 46.14,18.76 46.48,18.41 46.48,14.48 46.26,14.26 IC7.4 44.7,12.7 45.34,12.06 50.04,12.06 | IC8.1 58.84,18.89 59.18,18.54 59.18,14.73 58.84,14.39 IC8.4 57.4,12.95 56.52,12.06 50.04,12.06 | POWER.3 50.01,7.21 v50.04,7.24 | v50.04,9.91 50.04,12.06
  Bottom 0.305: v50.04,7.24 v50.04,9.91
D+  (via drill 0.35)
  Top 0.254: J3.A6 61.98,6.1 62.17,5.91 62.23,5.91 62.8,5.91 62.98,6.08 62.98,6.35 J3.B6
  Top 0.305: 62.98,6.35 62.99,6.34 v62.99,5.08 | v46.1,54.61 46.1,55.75 46.41,56.06 IC4.14
  Bottom 0.305: v62.99,5.08 63.63,4.45 64.29,4.45 64.61,4.13 68.04,4.13 69.63,5.71 69.63,8.09 46.1,31.62 v46.1,54.61
D-  (via drill 0.35)
  Top 0.305: J3.A7 62.48,8.64 62.1,9.02 61.72,9.02 61.48,8.78 J3.B7 61.48,5.47 v61.47,5.46 | v44.45,55.88 45.9,57.33 IC4.13
  Bottom 0.305: v61.47,5.46 61.47,6.38 44.45,23.4 v44.45,55.88
EN
  Top 0.305: R13.1 31.82,72.01 | 34.84,71.69 RST.3 | RST.3 34.59,71.83 | IC4.3 48.35,69.98 35.05,69.98 34.59,70.44 RST.3 | R13.1 31.88,71.82 | R13.1 RST.3
GND  (via drill 0.35)  (3 unrouted)
  Top 0.305: C5.2 C8.2 | BATT.1 28.51,8.46 C10.2 26.67,12.32 25.53,13.46 R14.1
  other vias: 4.7,21.08 5.21,20.19 5.84,21.08 6.35,20.19 6.99,21.08 7.49,20.19 8.13,21.08 9.27,21.08 8.64,20.19 4.7,22.86 5.84,22.86 6.99,22.86 8.13,22.86 9.27,22.86 5.33,23.75 6.48,23.75 7.62,23.75 8.76,23.75 36.83,35.56 36.83,33.02 41.91,35.56 41.91,33.02 30.48,26.67 35.56,25.4 6.35,48.26 12.7,45.72 53.34,16.51 54.61,6.35
  pour Top: 0,0 70.87,0 70.87,21.59 59.69,21.59 0,21.59
  pour Top: 0,57.15 21.59,57.15 40.64,57.15 40.64,46.99 49.53,46.99 49.53,22.35 0,22.35
  pour Top: 50.16,22.35 50.16,47.75 41.15,47.75 41.15,57.78 0,57.78 0,79.76 48.13,79.76 48.13,73.28 66.17,73.28 66.17,79.76 70.61,79.76 70.61,22.35
  pour Bottom: 48.13,80.01 48.13,73.41 66.17,73.41 66.17,80.01 70.87,80.01 70.87,0 0,0 0,80.01
INA  (via drill 0.35)
  Top 0.305: C1.1 7.62,26.66 8.13,26.16 v12.19,26.16 | v12.83,24.13 12.83,20.57 14.48,18.92 16.51,18.92 17.27,18.16 17.27,15.62 16.26,14.61 IC2.7
  Bottom 0.305: v12.19,26.16 13.08,25.27 13.08,24.38 v12.83,24.13
INA+
  Top 0.305: 7.45,9.67 J2.3
  Top 0.406: J2.3 6.94,10.92 7.45,11.43 IC2.4
INA-  (via drill 0.35)
  Top 0.305: IC2.1 5.33,15.88 4.83,16.38 4.83,17.27 5.21,17.65 14.1,17.65 v14.61,17.14 | v17.18,14.57 18.29,13.46 18.29,2.67 17.27,1.65 J2.2
  Bottom 0.305: v14.61,17.14 v17.18,14.57
IO0  (via drill 0.35)
  Top 0.305: R12.1 PRG.3 35.1,56.59 35.81,55.88 41.78,55.88 47.75,49.91 57.53,49.91 v59.69,52.07 | IC4.27 65.91,56.05 65.91,53.47 64.52,52.07 v62.23,52.07
  Bottom 0.305: v59.69,52.07 v62.23,52.07
N$1  (1 unrouted)
  Top 0.305: R3.2 15.37,38.1 16,37.47 16,35.94 16.81,35.14 C3.2 18.03,32 17.78,31.75
N$2
  Top 0.305: R1.1 C12.2 9.59,28.17 C1.2
N$3
  Top 0.305: C12.1 7.69,33.02 6.16,34.55 R2.2 6.16,37.28 5.4,38.03 IC1.3
N$4  (via drill 0.35)
  Top 0.305: IC3.3 18.1,37.27 v18.16,37.21 | v22.48,37.21 22.48,32.64 21.72,31.88 R4.1 20.35,28.73 C2.2
  Bottom 0.305: v18.16,37.21 v22.48,37.21
N$5
  Top 0.305: R10.1 IC5.4 32.91,38.72 33.4,38.23 33.4,35.63 R11.1
N$6
  Top 0.254: IC1.1 6.28,40.02 6.42,39.88 6.42,39.7 6.63,39.5 7.11,39.5 7.3,39.31 IC1.4
  Top 0.305: IC1.4 7.92,38.1 R3.1 11.49,38.07 R1.2
N$7
  Top 0.305: R8.2 5.04,14.77 5.21,14.61 IC2.2
N$8
  Top 0.305: R7.2 65.66,45.21 68.33,42.55 68.33,37.97 66.93,36.58 64.64,36.58 63.83,37.39 IC6.13
N$9  (via drill 0.35)
  Top 0.305: IC6.9 IC6.10 61.43,38.55 60.96,38.08 v60.96,37.34 | C6.2 C4.2 51.69,38.86 55.37,35.18 v60.96,35.18
  Bottom 0.305: v60.96,37.34 v60.96,35.18
N$10  (via drill 0.35)
  other vias: 10.16,48.26
N$11
  Top 0.305: R8.1 5.17,13.17 5.33,13.34 IC2.3
N$12
  Top 0.305: R6.2 64.58,35.11 63.25,36.45 55.5,36.45 53.47,38.48 53.47,42.29 56.01,44.83 61.98,44.83 63.03,43.78 IC6.3
N$13
  Top 0.305: R5.2 61.09,46.48 61.59,45.97 62.87,45.97 63.83,45.01 IC6.2
N$14  (via drill 0.35)
  Top 0.305: 21.97,8.96 R9.2 21.66,9.27 v24.77,9.27 | v33.02,9.27 36.8,9.27 CHRG.C
  Bottom 0.305: v24.77,9.27 v33.02,9.27
N$15  (via drill 0.35)
  other vias: 5.08,44.45
N$16
  Top 0.305: 65.04,11.22 65.04,10.83 | 65.04,11.22 R15.1 | J3.A5 60.98,10.56 61.64,11.22 65.04,11.22
N$17
  Top 0.305: R14.2 27.24,18.86 28.32,19.94 33.02,19.94 33.66,19.3 33.66,18.67 33.34,18.35 IC10.5
N$18  (via drill 0.35)
  Top 0.305: R9.1 v21.59,16.51 | v27.69,18.29 29.55,18.29 IC10.1
  Bottom 0.305: v21.59,16.51 21.59,17.78 22.1,18.29 v27.69,18.29
N$19
  Top 0.305: R16.2 68.04,11.21 68.04,10.01 67.56,9.53 64.64,9.53 63.98,8.86 J3.B5
N$20  (via drill 0.35)
  other vias: 31.75,46.99
N$21  (via drill 0.35)
  other vias: 35.56,53.34
N$22  (via drill 0.35)
  other vias: 39.37,46.99
N$23  (via drill 0.35)
  other vias: 31.75,53.34
N$24  (via drill 0.35)
  other vias: 13.97,63.5
N$25  (via drill 0.35)
  other vias: 36.83,45.72
N$26  (via drill 0.35)
  other vias: 53.34,45.72
OUT-ADC  (via drill 0.35)
  Top 0.305: R10.2 28.07,35.56 27.56,36.07 27.56,39.5 28.08,40.02 IC5.1 29.53,41.21 v29.46,41.27 | v44.2,64.9 48.35,64.9 IC4.7
  Bottom 0.305: v44.2,64.9 32.43,53.13 32.43,53.06 29.46,50.09 v29.46,41.27
OUTFILT  (via drill 0.35)
  Top 0.254: IC3.1 19.11,40.02 19.12,40.01 19.12,39.7 19.43,39.39 19.43,39.37 19.94,39.37 20,39.31 IC3.4
  Top 0.305: C3.1 20,35.2 IC3.4 25.03,38.72 v26.29,37.47 | IC5.3 29.53,37.78 v29.21,37.47
  Bottom 0.305: v29.21,37.47 v26.29,37.47
PPG
  Top 0.305: R7.1 65.66,51.69 68.2,54.23 68.2,59.05 67.38,59.87 IC4.30
SCL  (via drill 0.35)
  Top 0.305: R5.1 v61.09,53.34 | v68.33,71.25 65.95,71.25 IC4.39
  Bottom 0.305: v61.09,53.34 61.09,69.98 62.36,71.25 v68.33,71.25
SCL_DSP  (via drill 0.35)
  Top 0.305: OLED.4 43.18,50.8 45.72,48.26 v52.7,48.26 | v52.7,51.44 IC4.17
  Bottom 0.305: v52.7,48.26 v52.7,51.44
SDA
  Top 0.305: IC4.38 68.15,70.03 69.47,68.71 69.47,37.72 66.48,34.73 R6.1
SDA_DSP
  Top 0.305: OLED.3 20.32,53.34 21.59,54.61 26.67,54.61 27.94,55.88 27.94,64.77 29.21,66.04 42.16,66.04 43.18,65.02 43.18,59.69 44.32,58.55 48.35,58.55 IC4.12
VSS  (via drill 0.35)
  Top 0.406: R2.1 4.26,27.24 6.22,25.27 11.43,25.27 | 11.43,25.27 14.1,25.27 | 14.1,25.27 17.14,25.27 17.53,25.65 | C2.1 18.48,26.61 17.53,25.65 | IC9.1 14.93,20 14.1,20.83 14.1,25.27 | J2.1 7.09,1.76 v8,2.67 | v11.43,22.86 11.43,25.27 | IC2.6 v15.49,13.34 | v19.81,25.02 19.18,25.65 17.53,25.65
  Bottom 0.406: v8,2.67 8.64,3.3 9.78,3.3 10.16,3.68 10.16,19.05 11.43,20.32 v11.43,22.86 | v15.49,13.34 18.29,13.34 19.81,14.86 v19.81,25.02